# Altium schematic sheet Controller.SchDoc
size A4
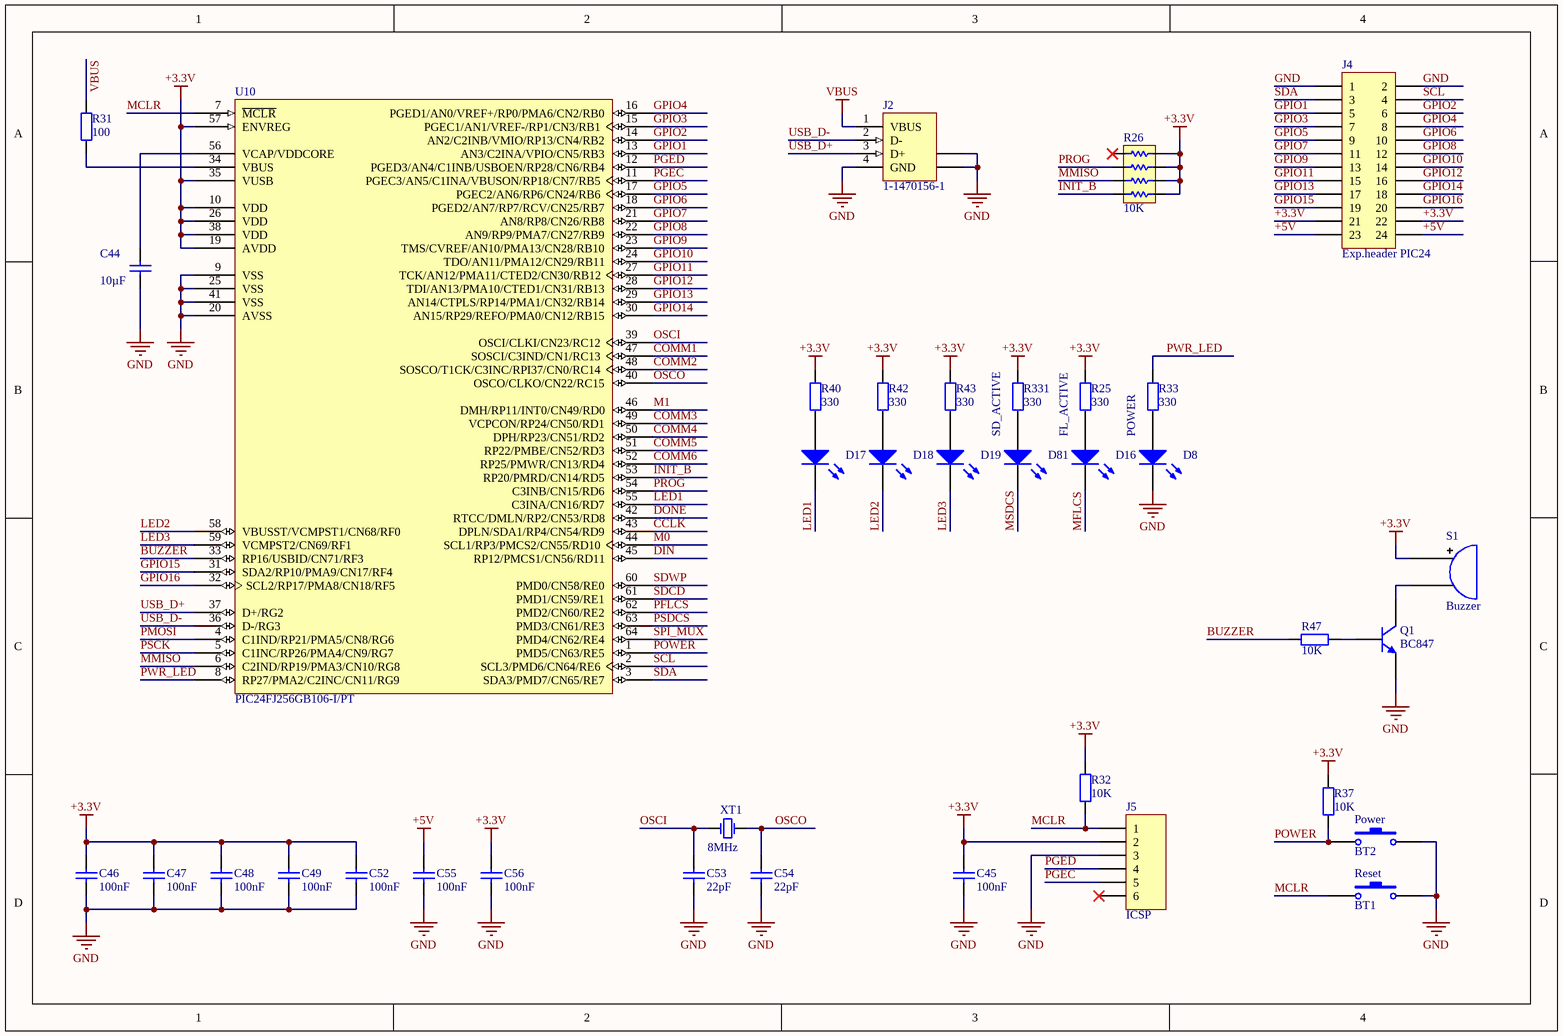
[diagram p0: Controller.SchDoc]

## Parts
C44  value 10µF  [6-0805_n]  (hidden comment: Cap)
C45  value 100nF  [6-0805_n]  (hidden comment: Cap)
C46  value 100nF  [6-0805_n]  (hidden comment: Cap)
C47  value 100nF  [6-0805_n]  (hidden comment: Cap)
C48  value 100nF  [6-0805_n]  (hidden comment: Cap)
C49  value 100nF  [6-0805_n]  (hidden comment: Cap)
C52  value 100nF  [6-0805_n]  (hidden comment: Cap)
C53  value 22pF  [6-0805_n]  (hidden comment: Cap)
C54  value 22pF  [6-0805_n]  (hidden comment: Cap)
C55  value 100nF  [6-0805_n]  (hidden comment: Cap)
C56  value 100nF  [6-0805_n]  (hidden comment: Cap)
D8  POWER  [HDR1X2]
D16  FL_ACTIVE  [HDR1X2]
D17  SD_ACTIVE  [6-0805_N]  (value not drawn)
D18  SD_ACTIVE  [6-0805_N]  (value not drawn)
D19  SD_ACTIVE  [6-0805_N]  (value not drawn)
D81  SD_ACTIVE  [HDR1X2]
J2  1-1470156-1  [440119]
J4  Exp.header PIC24  [HDR2X12]
J5  ICSP  [HDR1X6]
Power  BT2  [Push Button 6mm - Right Angle]
Q1  BC847  [SOT23_N]
R25  value 330  [6-0805_N]  (hidden comment: Res2)
R26  10K  [SMD 4 Resisor Network]
R31  value 100  [6-0805_N]  (hidden comment: Res2)
R32  value 10K  [6-0805_N]  (hidden comment: Res2)
R33  value 330  [6-0805_N]  (hidden comment: Res2)
R37  value 10K  [6-0805_N]  (hidden comment: Res2)
R40  value 330  [6-0805_N]  (hidden comment: Res2)
R42  value 330  [6-0805_N]  (hidden comment: Res2)
R43  value 330  [6-0805_N]  (hidden comment: Res2)
R47  value 10K  [RESC2012N]  (hidden comment: Resistor)
R331  value 330  [6-0805_N]  (hidden comment: Res2)
Reset  BT1  [Push Button 6mm]
S1  Buzzer  [Buzzer]
U10  PIC24FJ256GB106-I/PT  [TQFP-PT64_N]
XT1  value 8MHz  [Quartz HC-49]  (hidden comment: XTAL)

## Nets
+3.3V: C45.2 C46.1 C47.1 C48.1 C49.1 C52.1 C56.2 J4.21 J4.22 J5.2 R25.2 R26.2 R26.4 R26.6 R26.8 R32.2 R37.2 R40.2 R42.2 R43.2 R331.2 S1.1 U10.10(VDD) U10.19(AVDD) U10.26(VDD) U10.35(VUSB) U10.38(VDD) U10.57(ENVREG)
+5V: C55.2 J4.23 J4.24
GND: C44.1 C45.1 C46.2 C47.2 C48.2 C49.2 C52.2 C53.1 C54.1 C55.1 C56.1 D8.2(K) J2.4(GND) J2.5(SHLD) J2.6(SHLD) J4.1 J4.2 J5.3 Power.1 Q1.2(E) Reset.2 U10.9(VSS) U10.20(AVSS) U10.25(VSS) U10.41(VSS)
VBUS: J2.1(VBUS) R31.1
BUZZER: R47.1 U10.33(RP16/USBID/CN71/RF3)
CCLK: U10.43(DPLN/SDA1/RP4/CN54/RD9)
COMM1: U10.47(SOSCI/C3IND/CN1/RC13)
COMM2: U10.48(SOSCO/T1CK/C3INC/RPI37/CN0/RC14)
COMM3: U10.49(VCPCON/RP24/CN50/RD1)
COMM4: U10.50(DPH/RP23/CN51/RD2)
COMM5: U10.51(RP22/PMBE/CN52/RD3)
COMM6: U10.52(RP25/PMWR/CN13/RD4)
DIN: U10.45(RP12/PMCS1/CN56/RD11)
DONE: U10.42(RTCC/DMLN/RP2/CN53/RD8)
GPIO1: J4.5 U10.13(AN3/C2INA/VPIO/CN5/RB3)
GPIO2: J4.6 U10.14(AN2/C2INB/VMIO/RP13/CN4/RB2)
GPIO3: J4.7 U10.15(PGEC1/AN1/VREF-/RP1/CN3/RB1)
GPIO4: J4.8 U10.16(PGED1/AN0/VREF+/RP0/PMA6/CN2/RB0)
GPIO5: J4.9 U10.17(PGEC2/AN6/RP6/CN24/RB6)
GPIO6: J4.10 U10.18(PGED2/AN7/RP7/RCV/CN25/RB7)
GPIO7: J4.11 U10.21(AN8/RP8/CN26/RB8)
GPIO8: J4.12 U10.22(AN9/RP9/PMA7/CN27/RB9)
GPIO9: J4.13 U10.23(TMS/CVREF/AN10/PMA13/CN28/RB10)
GPIO10: J4.14 U10.24(TDO/AN11/PMA12/CN29/RB11)
GPIO11: J4.15 U10.27(TCK/AN12/PMA11/CTED2/CN30/RB12)
GPIO12: J4.16 U10.28(TDI/AN13/PMA10/CTED1/CN31/RB13)
GPIO13: J4.17 U10.29(AN14/CTPLS/RP14/PMA1/CN32/RB14)
GPIO14: J4.18 U10.30(AN15/RP29/REFO/PMA0/CN12/RB15)
GPIO15: J4.19 U10.31(SDA2/RP10/PMA9/CN17/RF4)
GPIO16: J4.20 U10.32(SCL2/RP17/PMA8/CN18/RF5)
INIT_B: R26.7 U10.53(RP20/PMRD/CN14/RD5)
LED1: D17.2(K) U10.55(C3INA/CN16/RD7)
LED2: D18.2(K) U10.58(VBUSST/VCMPST1/CN68/RF0)
LED3: D19.2(K) U10.59(VCMPST2/CN69/RF1)
M0: U10.44(SCL1/RP3/PMCS2/CN55/RD10)
M1: U10.46(DMH/RP11/INT0/CN49/RD0)
MCLR: J5.1 R32.1 Reset.1 U10.7(~{MCLR})
MFLCS: D16.2(K)
MMISO: R26.5 U10.6(C2IND/RP19/PMA3/CN10/RG8)
MSDCS: D81.2(K)
OSCI: C53.2 U10.39(OSCI/CLKI/CN23/RC12) XT1.2(OSC2)
OSCO: C54.2 U10.40(OSCO/CLKO/CN22/RC15) XT1.1(OSC1)
PFLCS: U10.62(PMD2/CN60/RE2)
PGEC: J5.5 U10.11(PGEC3/AN5/C1INA/VBUSON/RP18/CN7/RB5)
PGED: J5.4 U10.12(PGED3/AN4/C1INB/USBOEN/RP28/CN6/RB4)
PMOSI: U10.4(C1IND/RP21/PMA5/CN8/RG6)
POWER: Power.2 R37.1 U10.1(PMD5/CN63/RE5)
PROG: R26.3 U10.54(C3INB/CN15/RD6)
PSCK: U10.5(C1INC/RP26/PMA4/CN9/RG7)
PSDCS: U10.63(PMD3/CN61/RE3)
PWR_LED: R33.2 U10.8(RP27/PMA2/C2INC/CN11/RG9)
SCL: J4.4 U10.2(SCL3/PMD6/CN64/RE6)
SDA: J4.3 U10.3(SDA3/PMD7/CN65/RE7)
SDCD: U10.61(PMD1/CN59/RE1)
SDWP: U10.60(PMD0/CN58/RE0)
SPI_MUX: U10.64(PMD4/CN62/RE4)
USB_D+: J2.3(D+) U10.37(D+/RG2)
USB_D-: J2.2(D-) U10.36(D-/RG3)
NetC44_2: C44.2 U10.56(VCAP/VDDCORE)
NetD8_1: D8.1(A) R33.1
NetD16_1: D16.1(A) R25.1
NetD17_1: D17.1(A) R40.1
NetD18_1: D18.1(A) R42.1
NetD19_1: D19.1(A) R43.1
NetD81_1: D81.1(A) R331.1
NetQ1_1: Q1.1(B) R47.2
NetQ1_3: Q1.3(C) S1.2
NetR31_2: R31.2 U10.34(VBUS)

Not connected (* = marked no-connect by the designer): J5 6*; R26 1*

## Notes on the sheet
- Title
- Size:
- Date:
- A4
- Number:
- Time:
- Revision:
- Sheet
- of
- File:

## Library data of the parts
C44-C49 C52-C56 = Cap: Capacitor; Published: 8-Jun-2000; LatestRevisionDate: 17-Jul-2002; LatestRevisionNote: Re-released for DXP Platform.; PackageReference: RAD-0.3; Publisher: Altium Limited; PackageDescription: Radial Cap, Thru-Hole; 2 Leads; 0.3 in Pin Spacing
D8 D16-D19 D81 = LED0: Typical INFRARED GaAs LED; Published: 8-Jun-2000; LatestRevisionDate: 08-Jul-2005; LatestRevisionNote: Mech Layer 1 removed.; PackageReference: LED-0; Publisher: Altium Limited; PackageDescription: LED; 2 Leads
J2 = 1-1470156-1: USB 1.1, Right Angle, Thru-Hole, B Type, Receptacle, 4 Position, White; ContactMaterial: Phosphor Bronze; ContactPlating: Gold over Nickel; TerminationLength: 3.00mm [0.118in.]; PCB_Layout: Complies with manufacturer's recommendation.; DrillSize: Corresponds to nominal value.; PanelGround: Without; Published: 15-Jul-2004; DatasheetDocument: 02-Jun-2001; PackageDocument: 02-Jun-2001; PackageReference: 1-1470156; Publisher: Altium Limited; HousingMaterial: Glass-Filled Thermoplastic; ComponentLink1Description: Manufacturer Link; ComponentLink1URL: http://www.tycoelectronics.com/; ComponentLink2Description: Packaging Specification; ComponentLink2URL: http://ecommas.tycoelectronics.com/commerce/DocumentDelivery/DDEController?Action=showdoc&DocId=Customer+Drawing%7F1470156%7FO%7Ftif%7FEnglish%7FC_1470156_O.tif
J4 = Header 12X2: Header, 12-Pin, Dual row; LatestRevisionDate: 17-Jul-2002; LatestRevisionNote: Re-released for DXP Platform.; Publisher: Altium Limited
J5 = Header 6: Header, 6-Pin; LatestRevisionDate: 17-Jul-2002; LatestRevisionNote: Re-released for DXP Platform.; Publisher: Altium Limited
Power Reset = Push Button
Q1 = BF547: NPN 1 GHz Wideband Transistor; ComponentAvailability: Obsolete; Published: 17-Sep-2003; LatestRevisionDate: 12-Dec-2006; LatestRevisionNote: IPC-7351 Footprint Added.; DatasheetVersion: Sep-1995; PackageVersion: May-1999; PackageReference: SOT23; Publisher: Altium Limited; PackageDescription: 3-Pin SOT-23 Package 0.95 mm Pitch, 2.3 mm Lead Span; ComponentLink1Description: Manufacturer Link; ComponentLink1URL: http://www.semiconductors.philips.com/; ComponentLink2Description: Datasheet; ComponentLink2URL: http://www.semiconductors.philips.com/acrobat/datasheets/BF547_3.pdf; ComponentLink3Description: Discontinuation Notice; ComponentLink3URL: http://www.semiconductors.philips.com/pip/old/BF547.html
R25 R31-R33 R37 R40 R42 R43 R331 = Res2: Resistor; Published: 8-Jun-2000; LatestRevisionDate: 17-Jul-2002; LatestRevisionNote: Re-released for DXP Platform.; PackageReference: AXIAL-0.4; Publisher: Altium Limited; PackageDescription: Axial Device, Thru-Hole; 2 Leads; 0.4 in Pin Spacing
R26 = SMD 4 Resistor Network
S1 = Buzzer CEM-1206S/WT-1201: Magnetic Buzzer
U10 = PIC24FJ256GB106-I/PT: General Purpose 16-Bit Flash Microcontroller with USB On-The-Go, 256KB Flash, 16KB SRAM, 64-Pin TQFP, Industrial Temperature; Published: 29-Jan-2009; LatestRevisionDate: 07-Oct-2010; LatestRevisionNote: Updated to datasheet revision C, Dec-2009. Supplier links updated. Sch. pin names updated.; DatasheetVersion: revC, Dec-2009; PackageVersion: revBB, Aug-2009; PackageReference: TQFP-PT64; Publisher: Altium Limited; PackageDescription: 64-Lead Thin Plastic Quad Flat Pack (PT) - 10x10x1mm Body, 2.00mm [TQFP]; Supplier 1: Digi-Key; Supplier Part Number 1: PIC24FJ256GB106-I/PT-ND; Supplier 2: Farnell; Supplier Part Number 2: 1576868; Code_JEDEC: MS-026; ComponentLink1Description: Datasheet; ComponentLink1URL: http://ww1.microchip.com/downloads/en/DeviceDoc/39897c.pdf; ComponentLink2Description: Packaging Specification; ComponentLink2URL: http://www.microchip.com/stellent/groups/techpub_sg/documents/packagingspec/en012702.pdf; ComponentLink3Description: Microchip.com Home; ComponentLink3URL: http://www.microchip.com/
R47 = Resistor: Published: 8-Jun-2000; LatestRevisionDate: 17-Jul-2002; LatestRevisionNote: Re-released for DXP Platform.; PackageReference: AXIAL-0.4; Publisher: Altium Limited; PackageDescription: Axial Device, Thru-Hole; 2 Leads; 0.4 in Pin Spacing